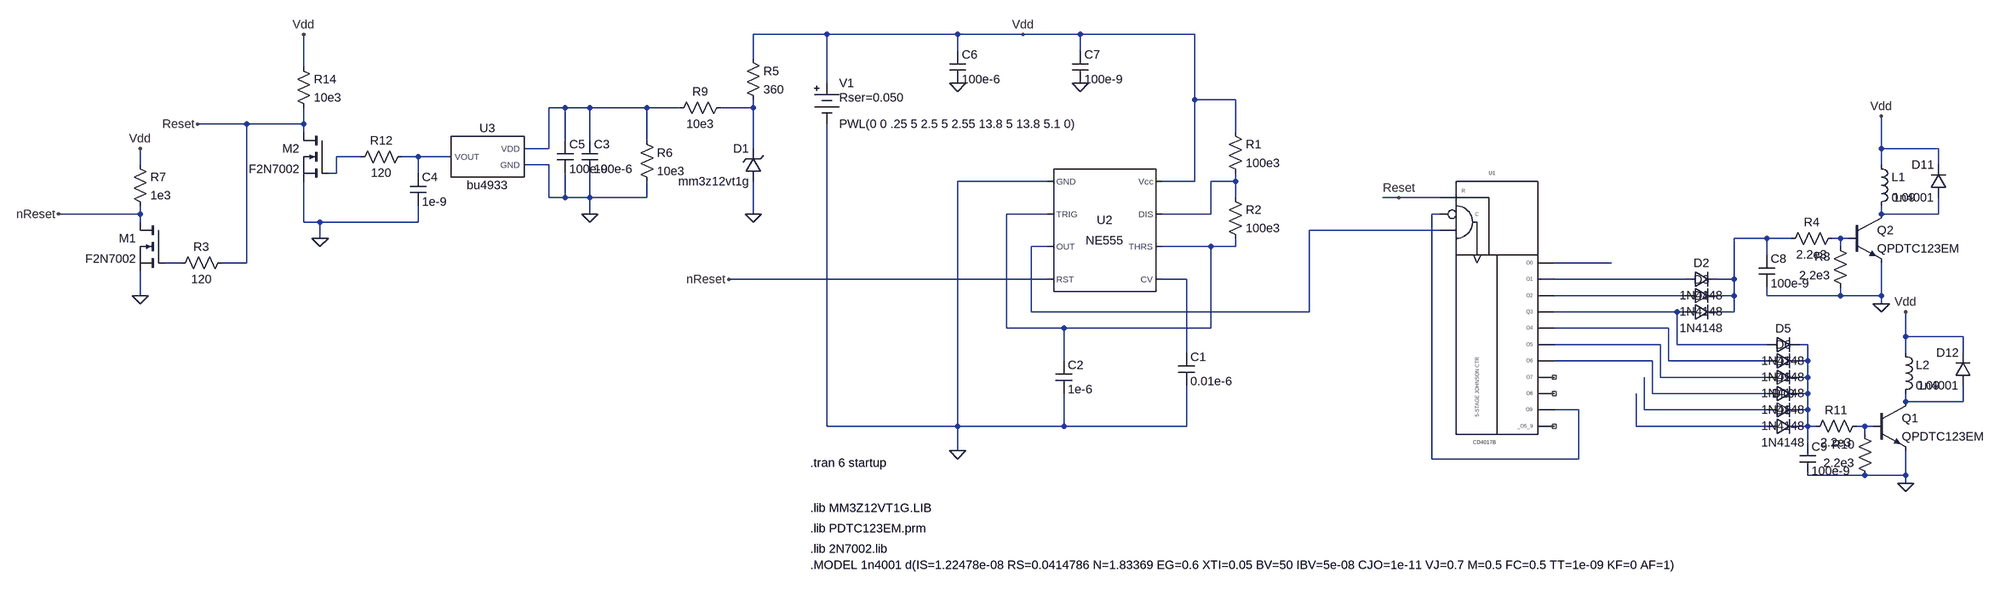
[diagram p0: schematic LockSequencer-3.asc]
LockSequencer-3.asc, the LTspice schematic file:
Version 4
SHEET 1 1412 720
WIRE -1088 -336 -1232 -336
WIRE -832 -336 -1088 -336
WIRE -704 -336 -832 -336
WIRE -592 -336 -704 -336
WIRE -368 -336 -592 -336
WIRE -832 -304 -832 -336
WIRE -592 -304 -592 -336
WIRE -1232 -288 -1232 -336
WIRE -2112 -272 -2112 -336
WIRE -1088 -240 -1088 -336
WIRE -368 -208 -368 -336
WIRE -288 -208 -368 -208
WIRE -1600 -192 -1632 -192
WIRE -1552 -192 -1600 -192
WIRE -1440 -192 -1552 -192
WIRE -1376 -192 -1440 -192
WIRE -1232 -192 -1232 -208
WIRE -1232 -192 -1296 -192
WIRE -2224 -160 -2320 -160
WIRE -2112 -160 -2112 -192
WIRE -2112 -160 -2224 -160
WIRE -2112 -144 -2112 -160
WIRE -288 -144 -288 -208
WIRE -1600 -128 -1600 -192
WIRE -1552 -128 -1552 -192
WIRE -1440 -128 -1440 -192
WIRE -1632 -112 -1632 -192
WIRE -1632 -112 -1680 -112
WIRE -1232 -112 -1232 -192
WIRE 976 -112 976 -176
WIRE 1088 -112 976 -112
WIRE -2000 -96 -2048 -96
WIRE -1888 -96 -1920 -96
WIRE -1824 -96 -1888 -96
WIRE -2432 -80 -2432 -112
WIRE -1632 -80 -1680 -80
WIRE 976 -80 976 -112
WIRE 1088 -80 1088 -112
WIRE -2048 -64 -2048 -96
WIRE -2048 -64 -2064 -64
WIRE -1888 -64 -1888 -96
WIRE -656 -48 -832 -48
WIRE -368 -48 -368 -208
WIRE -368 -48 -432 -48
WIRE -288 -48 -288 -64
WIRE -288 -48 -336 -48
WIRE -1632 -16 -1632 -80
WIRE -1600 -16 -1600 -64
WIRE -1600 -16 -1632 -16
WIRE -1552 -16 -1552 -64
WIRE -1552 -16 -1600 -16
WIRE -1440 -16 -1440 -48
WIRE -1440 -16 -1552 -16
WIRE -288 -16 -288 -48
WIRE 32 -16 0 -16
WIRE 112 -16 32 -16
WIRE -2432 16 -2432 0
WIRE -2432 16 -2592 16
WIRE -1552 16 -1552 -16
WIRE -1232 16 -1232 -48
WIRE -656 16 -736 16
WIRE -336 16 -336 -48
WIRE -336 16 -432 16
WIRE 112 16 96 16
WIRE 976 16 976 0
WIRE 1088 16 1088 -16
WIRE 1088 16 976 16
WIRE -2432 32 -2432 16
WIRE -2112 32 -2112 -48
WIRE -2080 32 -2112 32
WIRE -1888 32 -1888 0
WIRE -1888 32 -2080 32
WIRE 112 48 -144 48
WIRE -2080 64 -2080 32
WIRE 752 64 688 64
WIRE 800 64 752 64
WIRE 896 64 880 64
WIRE 912 64 896 64
WIRE -656 80 -688 80
WIRE -336 80 -432 80
WIRE -288 80 -288 64
WIRE -288 80 -336 80
WIRE 896 80 896 64
WIRE 752 96 752 64
WIRE -2352 112 -2384 112
WIRE -2224 112 -2224 -160
WIRE -2224 112 -2272 112
WIRE 448 112 336 112
WIRE -656 144 -1280 144
WIRE -384 144 -432 144
WIRE 592 144 336 144
WIRE 688 144 688 64
WIRE 688 144 656 144
WIRE -2432 176 -2432 128
WIRE 592 176 336 176
WIRE 688 176 688 144
WIRE 688 176 656 176
WIRE 752 176 752 160
WIRE 896 176 896 160
WIRE 896 176 752 176
WIRE 976 176 976 112
WIRE 976 176 896 176
WIRE 976 192 976 176
WIRE -688 208 -688 80
WIRE -144 208 -144 48
WIRE -144 208 -688 208
WIRE 576 208 336 208
WIRE 592 208 576 208
WIRE 688 208 688 176
WIRE 688 208 656 208
WIRE -736 240 -736 16
WIRE -624 240 -736 240
WIRE -336 240 -336 80
WIRE -336 240 -624 240
WIRE 560 240 336 240
WIRE 1024 256 1024 208
WIRE 1136 256 1024 256
WIRE 544 272 336 272
WIRE 576 272 576 208
WIRE 752 272 576 272
WIRE 832 272 816 272
WIRE -384 288 -384 144
WIRE 1024 288 1024 256
WIRE 1136 288 1136 256
WIRE -624 304 -624 240
WIRE 528 304 336 304
WIRE 560 304 560 240
WIRE 752 304 560 304
WIRE 832 304 832 272
WIRE 832 304 816 304
WIRE 544 336 544 272
WIRE 752 336 544 336
WIRE 832 336 832 304
WIRE 832 336 816 336
WIRE 528 368 528 304
WIRE 752 368 528 368
WIRE 832 368 832 336
WIRE 832 368 816 368
WIRE 1024 384 1024 368
WIRE 1136 384 1136 352
WIRE 1136 384 1024 384
WIRE 384 400 336 400
WIRE 512 400 512 336
WIRE 752 400 512 400
WIRE 832 400 832 368
WIRE 832 400 816 400
WIRE -1088 432 -1088 -160
WIRE -832 432 -832 -48
WIRE -832 432 -1088 432
WIRE -624 432 -624 368
WIRE -624 432 -832 432
WIRE -384 432 -384 352
WIRE -384 432 -624 432
WIRE 496 432 496 368
WIRE 752 432 496 432
WIRE 832 432 832 400
WIRE 832 432 816 432
WIRE 848 432 832 432
WIRE 944 432 928 432
WIRE 960 432 944 432
WIRE 944 448 944 432
WIRE 832 464 832 432
WIRE -832 480 -832 432
WIRE 96 496 96 16
WIRE 384 496 384 400
WIRE 384 496 96 496
WIRE 944 528 832 528
WIRE 1024 528 1024 480
WIRE 1024 528 944 528
WIRE 1024 544 1024 528
FLAG -832 480 0
FLAG -704 -336 Vdd
FLAG -1232 16 0
FLAG -1552 16 0
FLAG -2080 64 0
FLAG -2320 -160 Reset
FLAG 32 -16 Reset
FLAG -2432 -112 Vdd
FLAG -2112 -336 Vdd
FLAG -2592 16 nReset
FLAG -1280 144 nReset
FLAG -2432 176 0
FLAG 976 192 0
FLAG 1024 544 0
FLAG -832 -240 0
FLAG -592 -240 0
FLAG 976 -176 Vdd
FLAG 1024 208 Vdd
SYMBOL Misc\\NE555 -544 48 R0
SYMATTR InstName U2
SYMBOL Misc\\battery -1088 -256 R0
WINDOW 123 0 0 Left 2
WINDOW 39 24 44 Left 2
SYMATTR SpiceLine Rser=0.050
SYMATTR InstName V1
SYMATTR Value PWL(0 0 .25 5 2.5 5 2.55 13.8 5 13.8 5.1 0)
SYMBOL cap -400 288 R0
SYMATTR InstName C1
SYMATTR Value 0.01e-6
SYMATTR SpiceLine V=16
SYMBOL cap -640 304 R0
SYMATTR InstName C2
SYMATTR Value 1e-6
SYMATTR SpiceLine V=16
SYMBOL res -304 -160 R0
SYMATTR InstName R1
SYMATTR Value 100e3
SYMBOL res -304 -32 R0
SYMATTR InstName R2
SYMATTR Value 100e3
SYMBOL Dig_Add\\cd4017b 224 -80 R0
SYMATTR InstName U1
SYMATTR SpiceLine VDD=13.1  SPEED=1.0  TRIPDT=5e-9
SYMBOL zener -1216 -48 R180
WINDOW 0 24 64 Left 2
WINDOW 3 24 0 Left 2
SYMATTR InstName D1
SYMATTR Value mm3z12vt1g
SYMATTR Prefix X
SYMBOL res -1248 -304 R0
SYMATTR InstName R5
SYMATTR Value 360
SYMBOL cap -1568 -128 R0
SYMATTR InstName C3
SYMATTR Value 100e-6
SYMATTR SpiceLine V=16
SYMBOL cap -1904 -64 R0
SYMATTR InstName C4
SYMATTR Value 1e-9
SYMATTR SpiceLine V=16
SYMBOL res -1456 -144 R0
SYMATTR InstName R6
SYMATTR Value 10e3
SYMBOL res -1280 -208 R90
WINDOW 0 0 56 VBottom 2
WINDOW 3 32 56 VTop 2
SYMATTR InstName R9
SYMATTR Value 10e3
SYMBOL AutoGenerated\\bu4933 -1760 -96 R0
SYMATTR InstName U3
SYMBOL res -1904 -112 R90
WINDOW 0 0 56 VBottom 2
WINDOW 3 32 56 VTop 2
SYMATTR InstName R12
SYMATTR Value 120
SYMBOL res -2128 -288 R0
SYMATTR InstName R14
SYMATTR Value 10e3
SYMBOL nmos -2064 -144 M0
SYMATTR InstName M2
SYMATTR Value F2N7002
SYMATTR Prefix X
SYMBOL nmos -2384 32 M0
SYMATTR InstName M1
SYMATTR Value F2N7002
SYMATTR Prefix X
SYMBOL res -2256 96 R90
WINDOW 0 0 56 VBottom 2
WINDOW 3 32 56 VTop 2
SYMATTR InstName R3
SYMATTR Value 120
SYMBOL res -2448 -96 R0
SYMATTR InstName R7
SYMATTR Value 1e3
SYMBOL cap -1616 -128 R0
SYMATTR InstName C5
SYMATTR Value 100e-9
SYMATTR SpiceLine V=16
SYMBOL diode 592 160 R270
WINDOW 0 32 32 VTop 2
WINDOW 3 0 32 VBottom 2
SYMATTR InstName D2
SYMATTR Value 1N4148
SYMBOL diode 592 192 R270
WINDOW 0 32 32 VTop 2
WINDOW 3 0 32 VBottom 2
SYMATTR InstName D3
SYMATTR Value 1N4148
SYMBOL diode 592 224 R270
WINDOW 0 32 32 VTop 2
WINDOW 3 0 32 VBottom 2
SYMATTR InstName D4
SYMATTR Value 1N4148
SYMBOL diode 752 288 R270
WINDOW 0 32 32 VTop 2
WINDOW 3 0 32 VBottom 2
SYMATTR InstName D5
SYMATTR Value 1N4148
SYMBOL diode 752 320 R270
WINDOW 0 32 32 VTop 2
WINDOW 3 0 32 VBottom 2
SYMATTR InstName D6
SYMATTR Value 1N4148
SYMBOL diode 752 352 R270
WINDOW 0 32 32 VTop 2
WINDOW 3 0 32 VBottom 2
SYMATTR InstName D7
SYMATTR Value 1N4148
SYMBOL diode 752 448 R270
WINDOW 0 32 32 VTop 2
WINDOW 3 0 32 VBottom 2
SYMATTR InstName D8
SYMATTR Value 1N4148
SYMBOL diode 752 384 R270
WINDOW 0 32 32 VTop 2
WINDOW 3 0 32 VBottom 2
SYMATTR InstName D9
SYMATTR Value 1N4148
SYMBOL diode 752 416 R270
WINDOW 0 32 32 VTop 2
WINDOW 3 0 32 VBottom 2
SYMATTR InstName D10
SYMATTR Value 1N4148
SYMBOL npn 912 16 R0
SYMATTR InstName Q2
SYMATTR Value QPDTC123EM
SYMBOL res 896 48 R90
WINDOW 0 0 56 VBottom 2
WINDOW 3 32 56 VTop 2
SYMATTR InstName R4
SYMATTR Value 2.2e3
SYMBOL res 912 176 R180
WINDOW 0 36 76 Left 2
WINDOW 3 36 40 Left 2
SYMATTR InstName R8
SYMATTR Value 2.2e3
SYMBOL npn 960 384 R0
SYMATTR InstName Q1
SYMATTR Value QPDTC123EM
SYMBOL res 960 544 R180
WINDOW 0 36 76 Left 2
WINDOW 3 36 40 Left 2
SYMATTR InstName R10
SYMATTR Value 2.2e3
SYMBOL cap -848 -304 R0
SYMATTR InstName C6
SYMATTR Value 100e-6
SYMATTR SpiceLine V=16
SYMBOL cap -608 -304 R0
SYMATTR InstName C7
SYMATTR Value 100e-9
SYMATTR SpiceLine V=16
SYMBOL ind 960 -96 R0
SYMATTR InstName L1
SYMATTR Value 0.09
SYMATTR SpiceLine Rser=320
SYMBOL ind 1008 272 R0
SYMATTR InstName L2
SYMATTR Value 0.09
SYMATTR SpiceLine Rser=320
SYMBOL res 944 416 R90
WINDOW 0 0 56 VBottom 2
WINDOW 3 32 56 VTop 2
SYMATTR InstName R11
SYMATTR Value 2.2e3
SYMBOL cap 736 96 R0
SYMATTR InstName C8
SYMATTR Value 100e-9
SYMATTR SpiceLine V=16
SYMBOL cap 816 464 R0
SYMATTR InstName C9
SYMATTR Value 100e-9
SYMATTR SpiceLine V=16
SYMBOL diode 1104 -16 R180
WINDOW 0 24 64 Left 2
WINDOW 3 24 0 Left 2
SYMATTR InstName D11
SYMATTR Value 1n4001
SYMBOL diode 1152 352 R180
WINDOW 0 24 64 Left 2
WINDOW 3 24 0 Left 2
SYMATTR InstName D12
SYMATTR Value 1n4001
TEXT -1120 504 Left 2 !.tran 6 startup
TEXT -1120 592 Left 2 !.lib MM3Z12VT1G.LIB
TEXT -1120 632 Left 2 !.lib PDTC123EM.prm
TEXT -1120 672 Left 2 !.lib 2N7002.lib
TEXT -1120 704 Left 2 !.MODEL 1n4001 d(IS=1.22478e-08 RS=0.0414786 N=1.83369 EG=0.6 XTI=0.05 BV=50 IBV=5e-08 CJO=1e-11 VJ=0.7 M=0.5 FC=0.5 TT=1e-09 KF=0 AF=1)

The netlist it stands for:
* LockSequencer-3.asc
XU2 0 N006 N009 nReset N014 N006 N005 Vdd NE555  ; pins GND TRIG OUT RST CV THRS DIS Vcc
V1 Vdd 0 PWL(0 0 .25 5 2.5 5 2.55 13.8 5 13.8 5.1 0) Rser=0.050
C1 N014 0 0.01e-6 V=16
C2 N006 0 1e-6 V=16
R1 Vdd N005 100e3
R2 N005 N006 100e3
XU1 Reset N007 N009 N013 N015 N016 N017 N018 N019 N021 NC_01 NC_02 N007 NC_03 VDD 0 CD4017B VDD=13.1  SPEED=1.0  TRIPDT=5e-9  ; pins MR CPN CP Q0 Q1 Q2 Q3 Q4 Q5 Q6 Q7 Q8 Q9 Q59
XD1 0 N002 mm3z12vt1g  ; pins + -
R5 Vdd N002 360
C3 N001 0 100e-6 V=16
C4 N004 0 1e-9 V=16
R6 N001 0 10e3
R9 N002 N001 10e3
XU3 N004 N001 0 bu4933  ; pins VOUT VDD GND
R12 N004 N003 120
R14 Vdd Reset 10e3
XM2 Reset N003 0 F2N7002  ; pins D G S
XM1 nReset N012 0 F2N7002  ; pins D G S
R3 Reset N012 120
R7 Vdd nReset 1e3
C5 N001 0 100e-9 V=16
D2 N015 N010 1N4148
D3 N016 N010 1N4148
D4 N017 N010 1N4148
D5 N017 N020 1N4148
D6 N018 N020 1N4148
D7 N019 N020 1N4148
D8 N024 N020 1N4148
D9 N021 N020 1N4148
D10 N023 N020 1N4148
Q2 N008 N011 0 0 QPDTC123EM
R4 N011 N010 2.2e3
R8 0 N011 2.2e3
Q1 N022 N025 0 0 QPDTC123EM
R10 0 N025 2.2e3
C6 Vdd 0 100e-6 V=16
C7 Vdd 0 100e-9 V=16
L1 Vdd N008 0.09 Rser=320
L2 Vdd N022 0.09 Rser=320
R11 N025 N020 2.2e3
C8 N010 0 100e-9 V=16
C9 N020 0 100e-9 V=16
D11 N008 Vdd 1n4001
D12 N022 Vdd 1n4001
.model D D
.lib standard.dio
.model NPN NPN
.model PNP PNP
.lib standard.bjt
.tran 6 startup
.lib MM3Z12VT1G.LIB
.lib PDTC123EM.prm
.lib 2N7002.lib
.MODEL 1n4001 d(IS=1.22478e-08 RS=0.0414786 N=1.83369 EG=0.6 XTI=0.05 BV=50 IBV=5e-08 CJO=1e-11 VJ=0.7 M=0.5 FC=0.5 TT=1e-09 KF=0 AF=1)
.lib NE555.sub
.lib cd4000.lib
.lib BU4933.LIB
.backanno
.end